# Altium schematic sheet 02_ESP12_Backup.SchDoc: ESP12 Housing Board
size A4; SheetNumber: 1; SheetTotal: 3; PageSetup: Record=PageOptions|CenterHorizontal=True|CenterVertical=True|PrintScale=1.09|XCorrection=1.00|YCorrection=1.00|PrintKind=0|BorderSize=5000000|LeftOffset=0|BottomOffset=0|Orientation=2|PaperLength=1000|PaperWidth=1000|Scale=100|PaperSource=7|PrintQuality=-3|MediaType=1|DitherType=10|PrintScaleMode=1|PaperKind=A4|PaperIndex=9; SK_ProjectName: ESP8266 IoT Dimmer; Version: R01
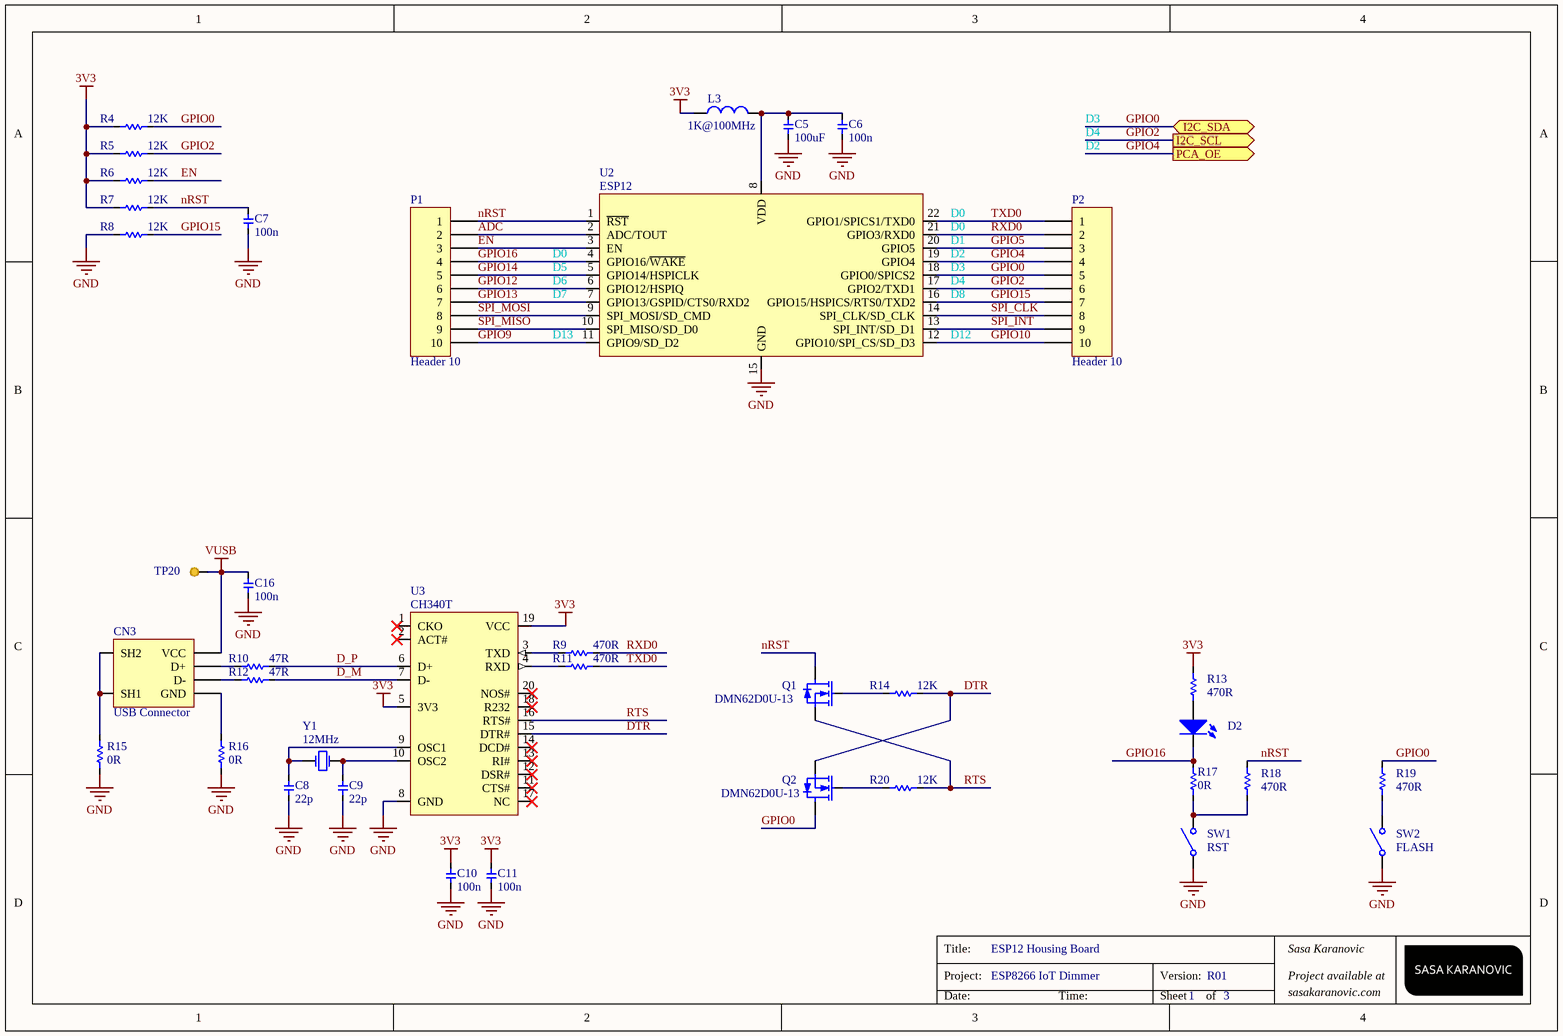
[diagram p0: 02_ESP12_Backup.SchDoc]

## Parts
C5  value 100uF  [CAPC_1411_3528_X08N]  (hidden comment: Cap)
C6  value 100n  [0603 - CAP]  (hidden comment: Cap)
C7  value 100n  [0603 - CAP]  (hidden comment: Cap)
C8  value 22p  [0603 - CAP]  (hidden comment: Cap)
C9  value 22p  [0603 - CAP]  (hidden comment: Cap)
C10  value 100n  [0603 - CAP]  (hidden comment: Cap)
C11  value 100n  [0603 - CAP]  (hidden comment: Cap)
C16  value 100n  [0603 - CAP]  (hidden comment: Cap)
CN3  USB Connector  [USB Mini SMD TOP]
D2  LED  [0603 Diode]  (value not drawn)
L3  value 1K@100MHz  [0603]  (hidden comment: Inductor)
P1  Header 10  [HDR1X10]
P2  Header 10  [HDR1X10]
Q1  DMN62D0U-13  [SOT90P240X100-3N]
Q2  DMN62D0U-13  [SOT90P240X100-3N]
R4  value 12K  [0603]  (hidden comment: Res)
R5  value 12K  [0603]  (hidden comment: Res)
R6  value 12K  [0603]  (hidden comment: Res)
R7  value 12K  [0603]  (hidden comment: Res)
R8  value 12K  [0603]  (hidden comment: Res)
R9  value 470R  [0603]  (hidden comment: Res)
R10  value 47R  [0603]  (hidden comment: Res)
R11  value 470R  [0603]  (hidden comment: Res)
R12  value 47R  [0603]  (hidden comment: Res)
R13  value 470R  [0603]  (hidden comment: Res)
R14  value 12K  [0603]  (hidden comment: Res)
R15  value 0R  [0603]  (hidden comment: Res)
R16  value 0R  [0603]  (hidden comment: Res)
R17  value 0R  [0603]  (hidden comment: Res)
R18  value 470R  [0603]  (hidden comment: Res)
R19  value 470R  [0603]  (hidden comment: Res)
R20  value 12K  [0603]  (hidden comment: Res)
SW1  Switch  [SMD Switch 2pin]  (value not drawn)
SW2  Switch  [SMD Switch 2pin]  (value not drawn)
TP20  Test Point 0.6mm  [TP_SMD_1mm]  (value not drawn)
U2  ESP12  [ESP-12]
U3  CH340T  [SOP20-5.30mm-0.65pitch]
Y1  12MHz  [XTAL SMD]

## Ports
I2C_SCL (out), I2C_SDA (bidir), PCA_OE (out)

## Nets
3V3: C10.2 C11.2 L3.1 R4.1 R5.1 R6.1 R7.1 R13.2 U3.5(3V3) U3.19(VCC)
GND: C5.1 C6.1 C7.1 C8.1 C9.1 C10.1 C11.1 C16.1 R8.1 R15.2 R16.2 SW1.1(COMMON1) SW2.1(COMMON1) U2.15(GND) U3.8(GND)
VUSB: C16.2 CN3.VCC TP20.1
ADC: P1.2 U2.2(ADC/TOUT)
D_M: R12.1 U3.7(D-)
D_P: R10.1 U3.6(D+)
DTR: Q2.3(S) R14.2 U3.15(DTR#)
EN: P1.3 R6.2 U2.3(EN)
GPIO0: P2.5 Q2.2(D) R4.2 R19.2 U2.18(GPIO0/SPICS2) ; port I2C_SDA
GPIO2: P2.6 R5.2 U2.17(GPIO2/TXD1) ; port I2C_SCL
GPIO4: P2.4 U2.19(GPIO4) ; port PCA_OE
GPIO5: P2.3 U2.20(GPIO5)
GPIO9: P1.10 U2.11(GPIO9/SD_D2)
GPIO10: P2.10 U2.12(GPIO10/SPI_CS/SD_D3)
GPIO12: P1.6 U2.6(GPIO12/HSPIQ)
GPIO13: P1.7 U2.7(GPIO13/GSPID/CTS0/RXD2)
GPIO14: P1.5 U2.5(GPIO14/HSPICLK)
GPIO15: P2.7 R8.2 U2.16(GPIO15/HSPICS/RTS0/TXD2)
GPIO16: D2.K P1.4 R17.1 U2.4(GPIO16/~{WAKE})
nRST: C7.2 P1.1 Q1.2(D) R7.2 R18.2 U2.1(~{RST})
RTS: Q1.3(S) R20.2 U3.16(RTS#)
RXD0: P2.2 R9.1 U2.21(GPIO3/RXD0)
SPI_CLK: P2.8 U2.14(SPI_CLK/SD_CLK)
SPI_INT: P2.9 U2.13(SPI_INT/SD_D1)
SPI_MISO: P1.9 U2.10(SPI_MISO/SD_D0)
SPI_MOSI: P1.8 U2.9(SPI_MOSI/SD_CMD)
TXD0: P2.1 R11.1 U2.22(GPIO1/SPICS1/TXD0)
NetC5_2: C5.2 C6.2 L3.2 U2.8(VDD)
NetC8_2: C8.2 U3.9(OSC1) Y1.1(OSC1)
NetC9_2: C9.2 U3.10(OSC2) Y1.2(OSC2)
NetCN3_D+: CN3.D+ R10.2
NetCN3_D-: CN3.D- R12.2
NetCN3_GND: CN3.GND R16.1
NetCN3_SH1: CN3.SH1 CN3.SH2 R15.1
NetD2_A: D2.A R13.1
NetQ1_1: Q1.1(G) R14.1
NetQ2_1: Q2.1(G) R20.1
NetR9_2: R9.2 U3.3(TXD)
NetR11_2: R11.2 U3.4(RXD)
NetR17_2: R17.2 R18.1 SW1.2(COMMON2)
NetR19_1: R19.1 SW2.2(COMMON2)

Not connected (* = marked no-connect by the designer): U3 1(CKO)* 2(ACT#)* 11(CTS#)* 12(DSR#)* 13(RI#)* 14(DCD#)* 17(NC)* 18(R232)* 20(NOS#)*

## Notes on the sheet
- D3
- D4
- D2
- (near U2) D0
- (near U2) D1
- (near U2) D5
- (near U2) D6
- (near U2) D7
- (near U2) D2
- (near U2) D3
- (near U2) D4
- (near U2) D8
- (near U2) D13
- (near U2) D12
- (near SW1) RST
- (near SW2) FLASH
- Title:
- Project:
- Version:
- sasakaranovic.com
- Sasa Karanovic
- Project available at
- Date:
- Time:
- Sheet
- of

## Library data of the parts
C5 = Cap: Capacitor; Manufacturer: AVX Corporation; Manufacturer Part Number: TAJB107M006RNJ; Distributor Part Number: 478-3877-1-ND; Distributor: DigiKey
C6-C11 C16 = Cap: Capacitor
CN3 = USB Connector: Header, 4-Pin; LatestRevisionDate: 17-Jul-2002; LatestRevisionNote: Re-released for DXP Platform.; Publisher: Altium Limited
D2 = LED: Typical RED GaAs LED; Published: 8-Jun-2000; LatestRevisionDate: 08-Jul-2005; LatestRevisionNote: Mech Layer 1 removed.; PackageReference: LED-1; Publisher: Altium Limited; PackageDescription: LED; 2 Leads
L3 = Inductor: FERRITE BEAD 1 KOHM 0603 1LN; Manufacturer: TDK Corporation; Manufacturer Part Number: MPZ1608S102ATA00; Distributor: DigiKey; Distributor Part Number: 445-8694-1-ND
P1 P2 = Header 10: Header, 10-Pin; LatestRevisionDate: 17-Jul-2002; LatestRevisionNote: Re-released for DXP Platform.; Publisher: Altium Limited
Q1 Q2 = DMN62D0U-13: MOSFET N-CH 60V 0.38A; pin to pad: 1>2 2>3 3>1; Manufacturer: Diodes Incorporated; Manufacturer Part Number: DMN62D0U-13; Distributor: DigiKey; Distributor Part Number: DMN62D0U-13DICT-ND
R4-R20 = Res: Resistor; Manufacturer: *; Manufacturer Part Number: *; Distributor: *; Distributor Part Number: *
TP20 = TP
U2 = ESP12: ESP8266 SMT Module - ESP-12S; Manufacturer: *; Manufacturer Part Number: *; Distributor: *; Distributor Part Number: *
U3 = CH340T: CH340T USB-to-UART
Y1 = XTAL: Crystal Oscillator; Published: 8-Jun-2000; LatestRevisionDate: 17-Jul-2002; LatestRevisionNote: Re-released for DXP Platform.; PackageReference: R38; Publisher: Altium Limited; PackageDescription: Crystal, Thru-Hole; 2 Leads; Body 3.1 x 8.2 mm (Dia.xH)